# Altium project POC_Marvin.PrjPcb
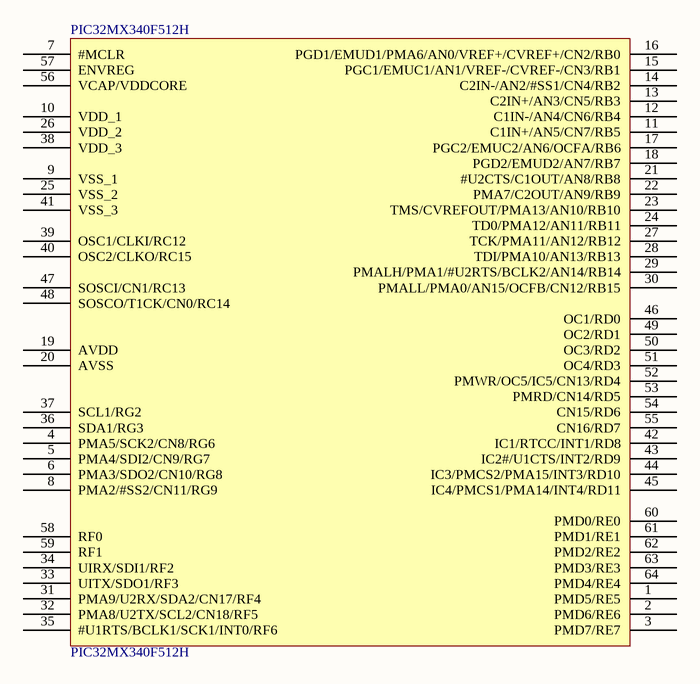
[diagram p0: PIC.SchDoc]
4 sheets, 9 parts. Net scope: flat (ports and power ports of the same name join across sheets).
Sheets:
  PIC.SchDoc
  Power.SchDoc
  Servo.SchDoc
  Sonar.SchDoc

## Sheet PIC.SchDoc
size A

### Parts
PIC32MX340F512H  PIC32MX340F512H

### Nets

Not connected (* = marked no-connect by the designer): PIC32MX340F512H 1(PMD5/RE5) 2(PMD6/RE6) 3(PMD7/RE7) 4(PMA5/SCK2/CN8/RG6) 5(PMA4/SDI2/CN9/RG7) 6(PMA3/SDO2/CN10/RG8) 7(#MCLR) 8(PMA2/#SS2/CN11/RG9) 9(VSS_1) 10(VDD_1) 11(C1IN+/AN5/CN7/RB5) 12(C1IN-/AN4/CN6/RB4) 13(C2IN+/AN3/CN5/RB3) 14(C2IN-/AN2/#SS1/CN4/RB2) 15(PGC1/EMUC1/AN1/VREF-/CVREF-/CN3/RB1) 16(PGD1/EMUD1/PMA6/AN0/VREF+/CVREF+/CN2/RB0) 17(PGC2/EMUC2/AN6/OCFA/RB6) 18(PGD2/EMUD2/AN7/RB7) 19(AVDD) 20(AVSS) 21(#U2CTS/C1OUT/AN8/RB8) 22(PMA7/C2OUT/AN9/RB9) 23(TMS/CVREFOUT/PMA13/AN10/RB10) 24(TD0/PMA12/AN11/RB11) 25(VSS_2) 26(VDD_2) 27(TCK/PMA11/AN12/RB12) 28(TDI/PMA10/AN13/RB13) 29(PMALH/PMA1/#U2RTS/BCLK2/AN14/RB14) 30(PMALL/PMA0/AN15/OCFB/CN12/RB15) 31(PMA9/U2RX/SDA2/CN17/RF4) 32(PMA8/U2TX/SCL2/CN18/RF5) 33(UITX/SDO1/RF3) 34(UIRX/SDI1/RF2) 35(#U1RTS/BCLK1/SCK1/INT0/RF6) 36(SDA1/RG3) 37(SCL1/RG2) 38(VDD_3) 39(OSC1/CLKI/RC12) 40(OSC2/CLKO/RC15) 41(VSS_3) 42(IC1/RTCC/INT1/RD8) 43(IC2#/U1CTS/INT2/RD9) 44(IC3/PMCS2/PMA15/INT3/RD10) 45(IC4/PMCS1/PMA14/INT4/RD11) 46(OC1/RD0) 47(SOSCI/CN1/RC13) 48(SOSCO/T1CK/CN0/RC14) 49(OC2/RD1) 50(OC3/RD2) 51(OC4/RD3) 52(PMWR/OC5/IC5/CN13/RD4) 53(PMRD/CN14/RD5) 54(CN15/RD6) 55(CN16/RD7) 56(VCAP/VDDCORE) 57(ENVREG) 58(RF0) 59(RF1) 60(PMD0/RE0) 61(PMD1/RE1) 62(PMD2/RE2) 63(PMD3/RE3) 64(PMD4/RE4)

## Sheet Power.SchDoc
size A
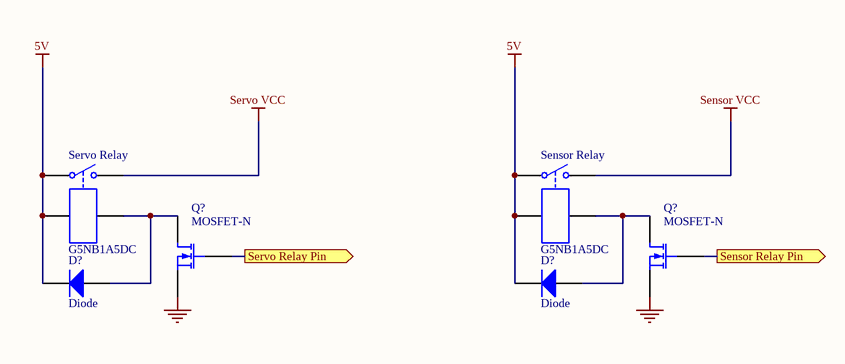
[diagram p1: Power.SchDoc]

### Parts
(Parts that share a designator on the sheet are numbered #1, #2 ... from top to bottom, then left to right.)
D?#1  Diode  [SMC]
D?#2  Diode  [SMC]
Q?#1  MOSFET-N  [E3]
Q?#2  MOSFET-N  [E3]
Sensor_Relay  G5NB1A5DC  [MODULE4]
Servo_Relay  G5NB1A5DC  [MODULE4]

### Ports
Sensor Relay Pin (out), Servo Relay Pin (out)

### Nets
5V: D?#1.2(K) D?#2.2(K) Sensor_Relay.1 Sensor_Relay.3 Servo_Relay.1 Servo_Relay.3
GND: Q?#1.3(S) Q?#2.3(S)
Sensor VCC: Sensor_Relay.2
Servo VCC: Servo_Relay.2
NetD?#1_1: D?#1.1(A) Q?#1.1(D) Servo_Relay.4
NetD?#2_1: D?#2.1(A) Q?#2.1(D) Sensor_Relay.4
NetQ?#1_2: Q?#1.2(G) ; port Servo Relay Pin
NetQ?#2_2: Q?#2.2(G) ; port Sensor Relay Pin

### Library data of the parts
D?#1 D?#2 = Diode: Default Diode; Published: 8-Jun-2000; LatestRevisionDate: 17-Jul-2002; LatestRevisionNote: Re-released for DXP Platform.; PackageVersion: Sep-1996; PackageReference: SMC; Publisher: Altium Limited; PackageDescription: DO-214-AB/SMC; 2 C-Bend Leads; Body 7.9 x 5.9 mm, inc. leads (LxW); Code_JEDEC: DO-214-AB
Q?#1 Q?#2 = MOSFET-N: N-Channel MOSFET; Published: 8-Jun-2000; LatestRevisionDate: 17-Jul-2002; LatestRevisionNote: Re-released for DXP Platform.; PackageVersion: 1995/1996; PackageReference: E3; Publisher: Altium Limited; PackageDescription: TO, Flat Index; 3 In-Line, Axial Leads; Body Dia. 4.6mm; Lead Dia. 0.5 mm (max)
Sensor_Relay Servo_Relay = Relay-SPST: Single-Pole Single-Throw Relay; Ref fournisseur: 2213805; Fournisseur: Farnell; Fabricant: OMRON; Ref Fabricant: G5NB1A5DC

## Sheet Servo.SchDoc
size A
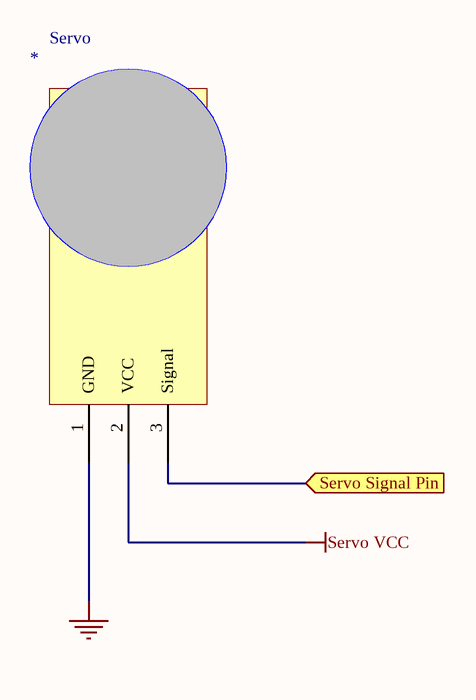
[diagram p2: Servo.SchDoc]

### Parts
(Parts that share a designator on the sheet are numbered #1, #2 ... from top to bottom, then left to right.)
*#1  Servo

### Ports
Servo Signal Pin (in)

### Nets
GND: *#1.1(GND)
Servo VCC: *#1.2(VCC)
Net*#1_3: *#1.3(Signal) ; port Servo Signal Pin

## Sheet Sonar.SchDoc
size A
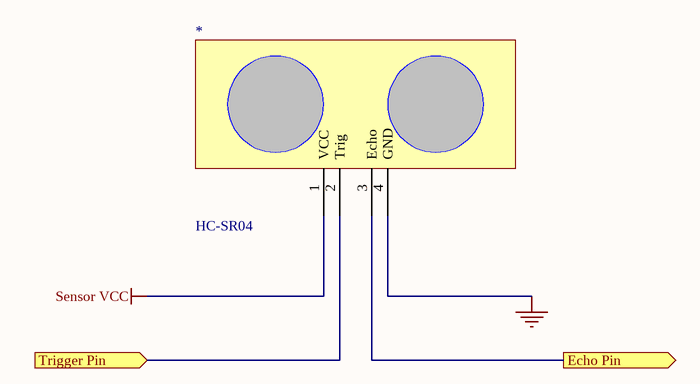
[diagram p3: Sonar.SchDoc]

### Parts
(Parts that share a designator on the sheet are numbered #1, #2 ... from top to bottom, then left to right.)
*#2  HC-SR04

### Ports
Echo Pin (out), Trigger Pin (in)

### Nets
GND: *#2.4(GND)
Sensor VCC: *#2.1(VCC)
Net*#2_2: *#2.2(Trig) ; port Trigger Pin
Net*#2_3: *#2.3(Echo) ; port Echo Pin

## Nets that join several sheets
GND: Power (Q?#1.3 Q?#2.3), Servo (*#1.1), Sonar (*#2.4)
Sensor VCC: Power (Sensor_Relay.2), Sonar (*#2.1)
Servo VCC: Power (Servo_Relay.2), Servo (*#1.2)